# EAGLE design Unified_Circuit (EAGLE 6.3)
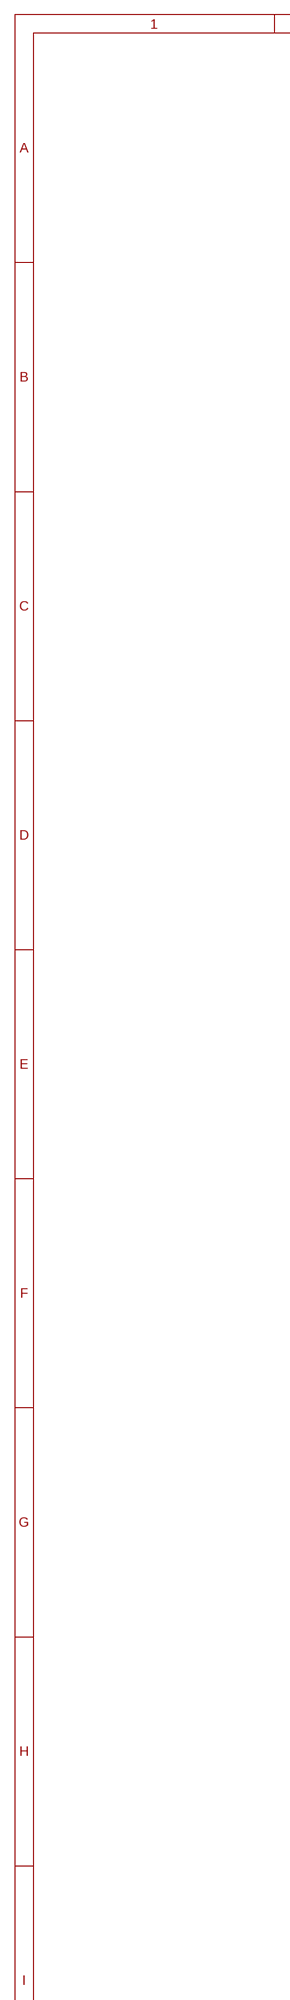
[diagram p0: schematic, sheet 1, part 1 of 2]
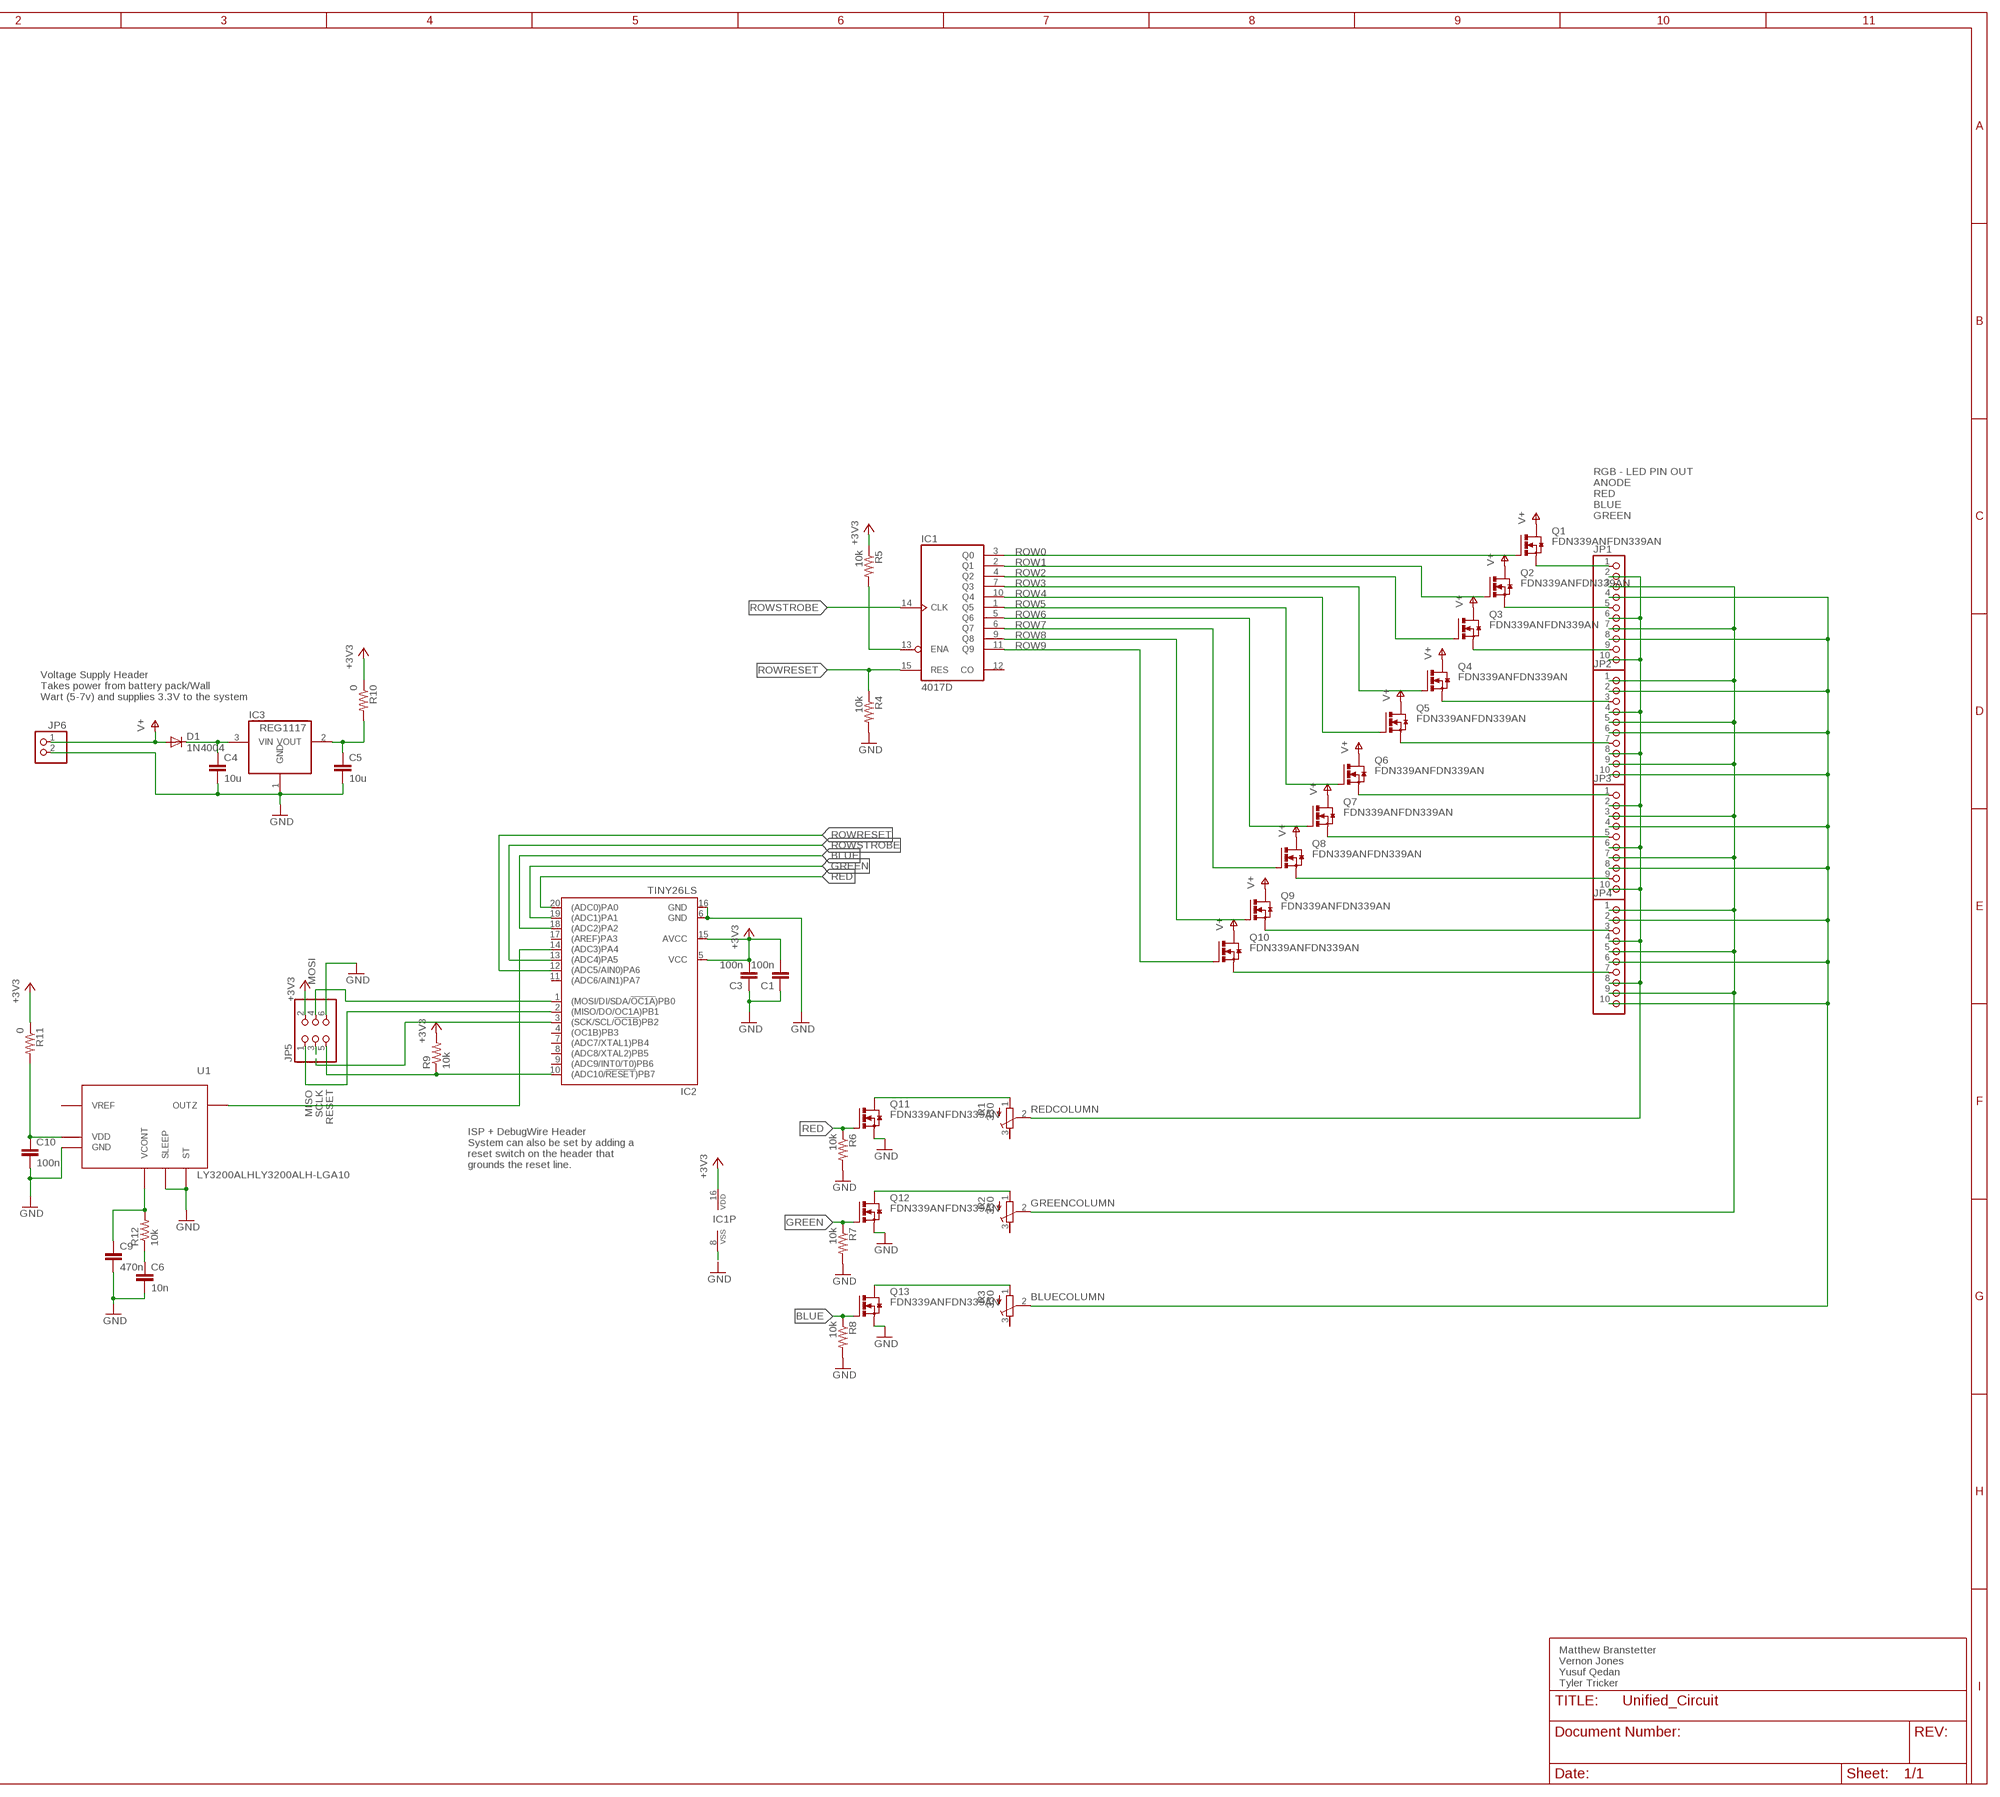
[diagram p1: schematic, sheet 1, part 2 of 2]

## Parts
C1  100n  C-EUC0805  [C0805]
C3  100n  C-EUC0805  [C0805]
C4  10u  C-EUC0805  [C0805]
C5  10u  C-EUC0805  [C0805]
C6  10n  C-EUC0805  [C0805]
C9  470n  C-EUC0805  [C0805]
C10  100n  C-EUC0805  [C0805]
D1  1N4004  [DO41-10]
IC1  4017D  [SO16]
IC2  TINY26LS  [SO20L]
IC3  REG1117  [SOT223]
JP1  PINHD-1X10/90  [1X10/90]
JP2  PINHD-1X10/90  [1X10/90]
JP3  PINHD-1X10/90  [1X10/90]
JP4  PINHD-1X10/90  [1X10/90]
JP5  PINHD-2X3  [2X03]
JP6  PINHD-1X2  [1X02]
Q1  FDN339ANFDN339AN  [SSOT-3]
Q2  FDN339ANFDN339AN  [SSOT-3]
Q3  FDN339ANFDN339AN  [SSOT-3]
Q4  FDN339ANFDN339AN  [SSOT-3]
Q5  FDN339ANFDN339AN  [SSOT-3]
Q6  FDN339ANFDN339AN  [SSOT-3]
Q7  FDN339ANFDN339AN  [SSOT-3]
Q8  FDN339ANFDN339AN  [SSOT-3]
Q9  FDN339ANFDN339AN  [SSOT-3]
Q10  FDN339ANFDN339AN  [SSOT-3]
Q11  FDN339ANFDN339AN  [SSOT-3]
Q12  FDN339ANFDN339AN  [SSOT-3]
Q13  FDN339ANFDN339AN  [SSOT-3]
R1  330  R-TRIMM3224W  [RTRIM3224W]
R2  330  R-TRIMM3224W  [RTRIM3224W]
R3  330  R-TRIMM3224W  [RTRIM3224W]
R4  10k  R-US_R0805  [R0805]
R5  10k  R-US_R0805  [R0805]
R6  10k  R-US_R0805  [R0805]
R7  10k  R-US_R0805  [R0805]
R8  10k  R-US_R0805  [R0805]
R9  10k  R-US_R0805  [R0805]
R10  0  R-US_R0805  [R0805]
R11  0  R-US_R0805  [R0805]
R12  10k  R-US_R0805  [R0805]
U1  LY3200ALHLY3200ALH-LGA10  [LGA10]

## Nets
+3V3: C1.2 C3.2 IC1.16(VDD) IC2.5(VCC) IC2.15(AVCC) JP5.2 R5.1 R9.2 R10.1 R11.1
BLUE: IC2.18((ADC2)PA2) Q13.P$2(G) R8.1
BLUECOLUMN: JP1.4 JP1.8 JP2.2 JP2.6 JP2.10 JP3.4 JP3.8 JP4.2 JP4.6 JP4.10 R3.2(S)
GND: C1.1 C3.1 C4.2 C5.2 C6.2 C9.2 C10.2 IC1.8(VSS) IC2.6(GND) IC2.16(GND) IC3.1(GND) JP5.6 JP6.2 Q11.P$3(S) Q12.P$3(S) Q13.P$3(S) R4.2 R6.2 R7.2 R8.2 U1.P$2(ST) U1.P$4(GND) U1.P$8(SLEEP)
GREEN: IC2.19((ADC1)PA1) Q12.P$2(G) R7.1
GREENCOLUMN: JP1.3 JP1.7 JP2.1 JP2.5 JP2.9 JP3.3 JP3.7 JP4.1 JP4.5 JP4.9 R2.2(S)
MISO: IC2.2((MISO/DO/OC1A)PB1) JP5.1
MOSI: IC2.1((MOSI/DI/SDA/!OC1A!)PB0) JP5.4
N$1: Q11.P$1(D) R1.1(A)
N$2: Q12.P$1(D) R2.1(A)
N$3: Q13.P$1(D) R3.1(A)
N$6: C4.1 D1.C IC3.3(VIN)
N$7: C5.1 IC3.2(VOUT) R10.2
N$9: IC2.14((ADC3)PA4) U1.P$6(OUTZ)
N$13: C6.1 R12.1
N$14: JP2.3 Q4.P$3(S)
N$15: JP2.7 Q5.P$3(S)
N$16: JP1.1 Q1.P$3(S)
N$17: JP1.5 Q2.P$3(S)
N$18: JP1.9 Q3.P$3(S)
N$19: JP3.1 Q6.P$3(S)
N$20: JP3.5 Q7.P$3(S)
N$21: JP3.9 Q8.P$3(S)
N$22: JP4.3 Q9.P$3(S)
N$23: JP4.7 Q10.P$3(S)
N$24: C9.1 R12.2 U1.P$3(VCONT)
N$27: C10.1 R11.2 U1.P$1(VDD) U1.P$9(VDD)
PA1: IC1.13(ENA) R5.2
RED: IC2.20((ADC0)PA0) Q11.P$2(G) R6.1
REDCOLUMN: JP1.2 JP1.6 JP1.10 JP2.4 JP2.8 JP3.2 JP3.6 JP3.10 JP4.4 JP4.8 R1.2(S)
RESET: IC2.10((ADC10/!RESET!)PB7) JP5.5 R9.1
ROW0: IC1.3(Q0) Q1.P$2(G)
ROW1: IC1.2(Q1) Q2.P$2(G)
ROW2: IC1.4(Q2) Q3.P$2(G)
ROW3: IC1.7(Q3) Q4.P$2(G)
ROW4: IC1.10(Q4) Q5.P$2(G)
ROW5: IC1.1(Q5) Q6.P$2(G)
ROW6: IC1.5(Q6) Q7.P$2(G)
ROW7: IC1.6(Q7) Q8.P$2(G)
ROW8: IC1.9(Q8) Q9.P$2(G)
ROW9: IC1.11(Q9) Q10.P$2(G)
ROWRESET: IC1.15(RES) IC2.12((ADC5/AIN0)PA6) R4.1
ROWSTROBE: IC1.14(CLK) IC2.13((ADC4)PA5)
SCLK: IC2.3((SCK/SCL/!OC1B!)PB2) JP5.3
V+: D1.A JP6.1 Q1.P$1(D) Q2.P$1(D) Q3.P$1(D) Q4.P$1(D) Q5.P$1(D) Q6.P$1(D) Q7.P$1(D) Q8.P$1(D) Q9.P$1(D) Q10.P$1(D)
Unconnected: IC1.12(CO) IC2.4((OC1B)PB3) IC2.7((ADC7/XTAL1)PB4) IC2.8((ADC8/XTAL2)PB5) IC2.9((ADC9/INT0/T0)PB6) IC2.11((ADC6/AIN1)PA7) IC2.17((AREF)PA3) R1.3(E) R2.3(E) R3.3(E) U1.P$7(VREF)

## Notes on the sheet
- RGB - LED PIN OUT
  ANODE
  RED
  BLUE
  GREEN
- Voltage Supply Header
  Takes power from battery pack/Wall
  Wart (5-7v) and supplies 3.3V to the system
- ISP + DebugWire Header
  System can also be set by adding a
  reset switch on the header that
  grounds the reset line.
- Matthew Branstetter
  Vernon Jones
  Yusuf Qedan
  Tyler Tricker

## Library data of the parts
C1 C3-C6 C9 C10 = rcl:C-EU: CAPACITOR, European symbol
D1 = diode:1N4004: DIODE general purpose rectifier, 1 A
IC1 = 40xx:4017: COUNTER/DIVIDER
IC2 = atmel:TINY26*: 8-bit AVR Microcontroller with 2K Bytes Flash Source: http://www.atmel.com .. doc1477.pdf; MPN: ATTINY26L-8SU; OC_FARNELL: 9171665; OC_NEWARK: 01M6921
IC3 = burr-brown:REG1117: 800mA and 1A Low Dropout (LDO) Positive Regulator 1.8V, 2.5V, 2.85V, 3.3V, 5V, and Adj; MPN: REG1117; OC_FARNELL: 1097566; OC_NEWARK: 14P6981
JP1-JP4 = pinhead:PINHD-1X10: PIN HEADER
JP5 = pinhead:PINHD-2X3: PIN HEADER
JP6 = pinhead:PINHD-1X2: PIN HEADER
Q1-Q13 = symbols:FDN339AN
R1-R3 = rcl:R-TRIMM: Trimm resistor
R4-R12 = rcl:R-US_: RESISTOR, American symbol
U1 = symbols:LY3200ALH: MEMS motion sensor: high performance ±2000 dps analog yaw-rate gyroscope

## Board
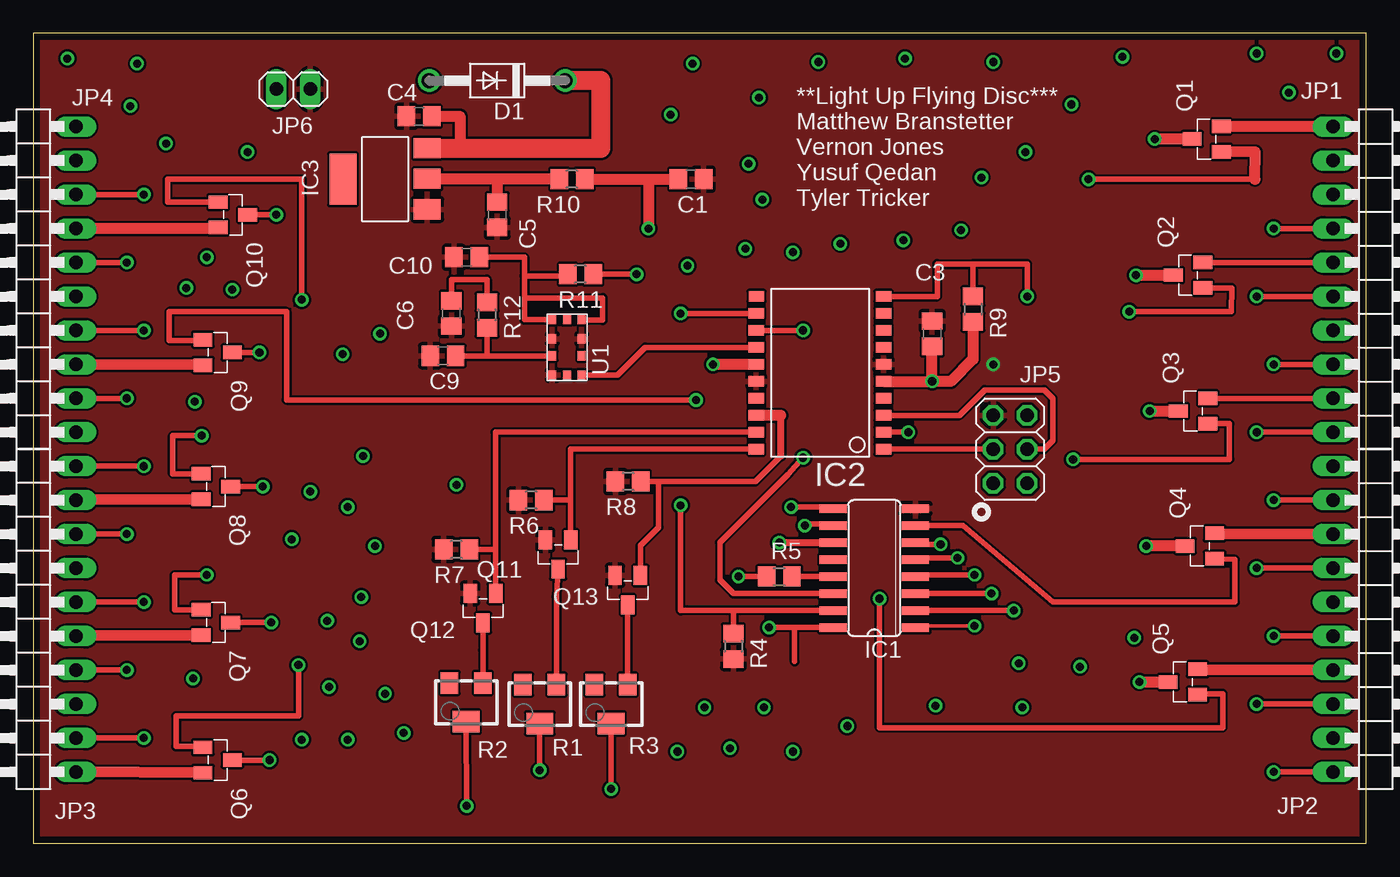
[diagram p2: board, top side]
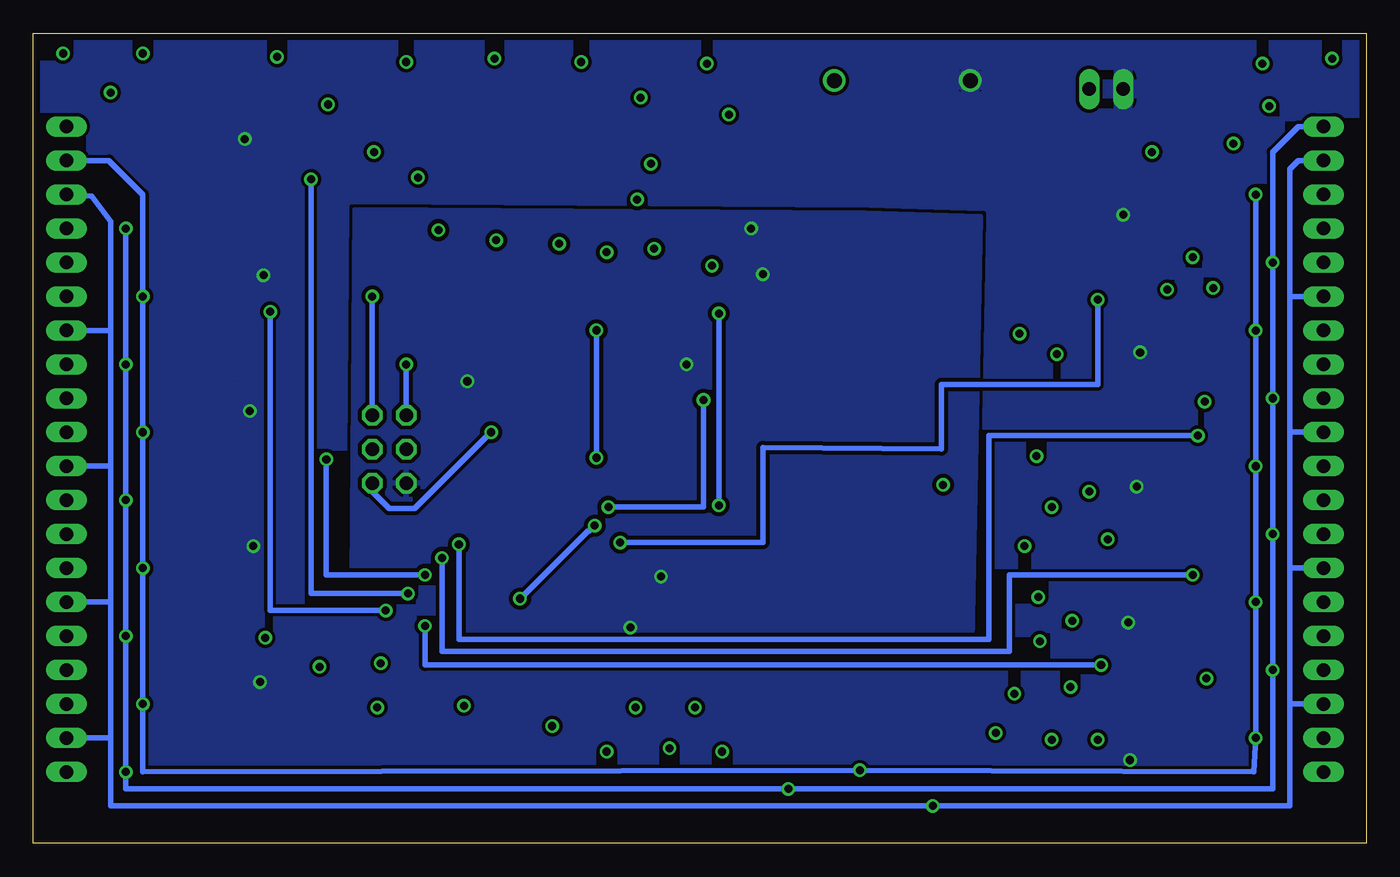
[diagram p3: board, bottom side, seen from below]

Size 99.62 x 60.55 mm. Coordinates in mm from the lower left corner, seen from the top.
Outline: 0,0 99.62,0 99.62,60.55 0,60.55 0,0
Copper layers (1*16): Top 0.0178mm / dielectric 59mil / Bottom 0.0178mm
Design rules "sunstone-valueproto": minimum track width 7mil, minimum drill 16mil, track to track 7mil, track to pad 7mil, pad to pad 7mil, via to via 7mil, smd to smd 7mil, copper to edge 20mil, drill to drill 16mil, minimum pad ring 8mil, minimum via ring 8mil, stop-mask expansion 3mil, vias tented up to drill 0mil, thermal gap 10mil

### Footprints (pad centres in the part's own frame; a part is rotated, then mirrored left to right if it is on the bottom)
C0805 = smd 1.3 x 1.5: 1 -0.95,0; 2 0.95,0
DO41-10 = drill 1.118: A 5.08,0; C -5.08,0
SO16 = smd 0.66 x 2.032: 1 -4.445,-3.073; 2 -3.175,-3.073; 3 -1.905,-3.073; 4 -0.635,-3.073; 5 0.635,-3.073; 6 1.905,-3.073; 7 3.175,-3.073; 8 4.445,-3.073; 9 4.445,3.073; 10 3.175,3.073; 11 1.905,3.073; 12 0.635,3.073; 13 -0.635,3.073; 14 -1.905,3.073; 15 -3.175,3.073; 16 -4.445,3.073
SO20L = smd 0.762 x 1.143: 1 -5.08,-5.131; 2 -3.81,-5.131; 3 -2.54,-5.131; 4 -1.27,-5.131; 5 0,-5.131; 6 1.27,-5.131; 7 2.54,-5.131; 8 3.81,-5.131; 9 5.08,-5.131; 10 6.35,-5.131; 11 6.35,4.369; 12 5.08,4.394; 13 3.81,4.394; 14 2.54,4.394; 15 1.27,4.394; 16 0,4.394; 17 -1.27,4.394; 18 -2.54,4.394; 19 -3.81,4.394; 20 -5.08,4.394
SOT223 = smd 1.499 x 2.007: 1 -2.261,-3.15; 2 0.025,-3.15; 3 2.311,-3.15 | smd 3.81 x 2.007: 4 0,3.15
1X10/90 = drill 1.016 long: 1 -11.43,-3.81; 2 -8.89,-3.81; 3 -6.35,-3.81; 4 -3.81,-3.81; 5 -1.27,-3.81; 6 1.27,-3.81; 7 3.81,-3.81; 8 6.35,-3.81; 9 8.89,-3.81; 10 11.43,-3.81
2X03 = drill 1.016 octagon: 1 -2.54,-1.27; 2 -2.54,1.27; 3 0,-1.27; 4 0,1.27; 5 2.54,-1.27; 6 2.54,1.27
1X02 = drill 1.016 long: 1 -1.27,0; 2 1.27,0
SSOT-3 = smd 1 x 1.4: P$1 0,1.1; P$2 -0.95,-1.1; P$3 0.95,-1.1
RTRIM3224W = smd 1.3 x 1.6: 1 -1.25,-1.45; 3 1.25,-1.45 | smd 2 x 1.6: 2 0,1.45
R0805 = smd 1.3 x 1.5: 1 -0.95,0; 2 0.95,0
LGA10 = smd 0.7 x 0.6: P$1 -2.075,-1.1; P$2 -0.635,-1.1; P$3 0.635,-1.1; P$4 2.075,-1.1; P$5 2.075,0; P$6 2.075,1.1; P$7 0.635,1.1; P$8 -0.635,1.1; P$9 -2.075,1.1; P$10 -2.075,0

### Placement (x,y rotation side)
C1  49.15,49.66 180 top
C3  67.18,38.1 270 top
C4  28.83,54.36 180 top
C5  34.67,46.99 270 top
C6  31.24,39.62 270 top
C9  30.61,36.45 180 top
C10  32.38,43.81 180 top
D1  34.67,57.02 180 top
IC1  62.87,20.57 90 top
IC2  58.42,34.54 90 top
IC3  26.29,49.66 90 top
JP1  100.97,42.16 270 top
JP2  100.97,16.76 270 top
JP3  -0.64,16.76 90 top
JP4  -0.64,42.16 90 top
JP5  73.03,29.46 90 top
JP6  19.43,56.39 0 top
Q1  87.71,52.65 90 top
Q2  86.31,42.48 90 top
Q3  86.69,32.32 90 top
Q4  87.2,22.23 90 top
Q5  85.93,12.07 90 top
Q6  13.77,6.22 270 top
Q7  13.64,16.51 270 top
Q8  13.64,26.67 270 top
Q9  13.77,36.7 270 top
Q10  14.91,46.99 270 top
Q11  39.22,21.59 180 top
Q12  33.6,17.58 180 top
Q13  44.42,18.92 180 top
R1  37.85,10.41 180 top
R2  32.35,10.54 180 top
R3  43.18,10.41 180 top
R4  52.32,14.73 270 top
R5  55.75,19.94 0 top
R6  37.21,25.65 180 top
R7  31.62,21.97 180 top
R8  44.45,27.05 180 top
R9  70.23,39.94 270 top
R10  40.26,49.66 180 top
R11  40.89,42.55 180 top
R12  33.91,39.5 270 top
U1  39.88,37.08 270 top

### Tracks (layer width: path | path; a pad name or v marks a point on that pad's centre or on a via)
+3V3  (via drill 0.6)
  Top 0.406: R11.1 v45.09,42.55 | v52.7,19.94 R5.1 | IC1.16 56.9,16.13 | 56.9,16.13 v54.99,16.13 | 56.9,13.59 56.9,16.13
  Top 0.813: IC2.15 v50.8,35.81 | IC2.5 v67.18,34.54 | v67.18,34.54 C3.2 | R10.1 45.97,49.66 | 45.97,49.66 v45.97,45.97 | R9.2 70.23,36.2 68.58,34.54 v67.18,34.54 | 45.97,49.66 C1.2
  pour Bottom (isolate 0.305): 37.47,47.12 75.56,47.37 75.82,15.11 29.46,14.99 28.83,46.86
BLUE
  Top 0.406: R8.1 46.74,27.05 | 46.74,27.05 53.98,27.05 55.88,28.96 | Q13.P$2 45.38,22.26 46.74,23.62 46.74,27.05
  Top 0.508: 55.88,28.96 55.88,32
  Top 0.813: 55.88,32 IC2.18
BLUECOLUMN  (via drill 0.6)
  Top 0.406: R3.2 v43.18,4.06 | JP4.6 v6.99,43.43 | v6.99,23.11 JP3.8 | JP3.4 v6.99,12.95 | JP4.2 v6.99,33.27 | v92.71,45.97 JP1.4 | v92.71,35.81 JP1.8 | JP2.10 v92.71,5.33 | JP2.2 v92.71,25.65 | JP2.6 v92.71,15.49
  Bottom 0.406: JP4.10 5.08,53.59 6.99,51.69 v6.99,43.43 v6.99,33.27 v6.99,23.11 v6.99,12.95 6.99,4.06 v43.18,4.06 92.71,4.06 v92.71,5.33 v92.71,15.49 v92.71,25.65 v92.71,35.81 v92.71,45.97
GND  (via drill 0.6)
  Bottom 0.406: JP5.6 v71.75,35.81
  pour Top: -0.51,-11.81 101.22,-12.32 101.47,62.74 -0.64,62.74
GREEN
  Top 0.406: IC2.19 34.54,30.73 34.55,23.11 34.55,21.97 | 34.55,21.97 Q12.P$2 | R7.1 34.55,21.97
GREENCOLUMN  (via drill 0.6)
  Top 0.406: R2.2 v32.38,2.79
  Bottom 0.406: JP4.9 5.08,51.05 5.71,50.42 5.71,40.89 | 5.71,40.89 5.71,30.73 | 5.71,30.73 5.71,20.57 | 5.71,20.57 5.71,10.41 | 5.71,10.41 5.71,2.79 v32.38,2.79 93.85,2.79 93.85,7.87 | JP4.5 5.71,40.89 | JP4.1 5.71,30.73 | JP3.7 5.71,20.57 | JP3.3 5.71,10.41 | 93.85,38.35 93.85,46.48 95.25,48.39 JP1.3 | 93.85,38.35 93.85,28.19 | 93.85,28.19 93.85,18.03 | 93.85,18.03 93.85,7.87 | JP1.7 93.85,38.35 | JP2.5 93.85,18.03 | JP2.1 93.85,28.19 | JP2.9 93.85,7.87
MISO  (via drill 0.6)
  Top 0.406: IC2.2 v65.41,30.73
  Bottom 0.406: JP5.1 74.3,26.29 73.03,25.02 71.12,25.02 v65.41,30.73
MOSI
  Top 0.406: JP5.4 IC2.1
N$1
  Top 0.406: Q11.P$1 39.1,18.46 R1.1
N$2
  Top 0.406: Q12.P$1 33.6,14.45 R2.1
N$3
  Top 0.406: Q13.P$1 44.42,11.36 R3.1
N$5  (via drill 0.6)
  other vias: 91.44,59.05
N$6
  Top 0.813: C4.1 31.88,54.36 31.88,51.97
  Top 1.422: IC3.3 31.88,51.97 42.42,51.97 42.42,57.02 D1.C
N$7
  Top 0.406: 39.31,49.68 R10.2
  Top 0.813: IC3.2 34.67,49.68 | 34.67,49.68 C5.1 | 34.67,49.68 39.31,49.68
N$8  (via drill 0.6)
  other vias: 97.41,59.05
N$9
  Top 0.406: U1.P$6 43.65,35.01 45.72,37.08 IC2.14
N$10  (via drill 0.6)
  other vias: 93.85,56.13
N$12  (via drill 0.6)
  other vias: 81.41,58.8
N$13
  Top 0.406: C6.1 31.24,42.16 33.91,42.16 R12.1
N$14
  Top 0.406: JP2.3
  Top 0.813: Q4.P$3 JP2.3
N$15
  Top 0.406: JP2.7
  Top 0.813: Q5.P$3 JP2.7
N$16
  Top 0.406: JP1.1
  Top 0.813: Q1.P$3 JP1.1
N$17
  Top 0.406: Q2.P$3 95.5,43.43 JP1.5
N$18
  Top 0.406: JP1.9 | Q3.P$3 JP1.9
N$19
  Top 0.406: JP3.1
  Top 0.813: Q6.P$3 JP3.1
N$20
  Top 0.406: JP3.5
  Top 0.813: Q7.P$3 JP3.5
N$21
  Top 0.406: JP3.9
  Top 0.813: Q8.P$3 JP3.9
N$22
  Top 0.406: JP4.3
  Top 0.813: Q9.P$3 JP4.3
N$23
  Top 0.406: 13.81,45.97 Q10.P$3 | JP4.7
  Top 0.813: 13.81,45.97 JP4.7
N$24
  Top 0.406: 33.91,36.45 R12.2 | C9.1 33.91,36.45 | 33.91,36.45 U1.P$3
N$25  (via drill 0.6)
  other vias: 77.6,55.24
N$26  (via drill 0.6)
  other vias: 74.17,51.69
N$27
  Top 0.406: C10.1 36.7,43.81 36.7,42.42 | 41.4,39.16 U1.P$9 41.38,39.12 42.55,39.12 42.55,40.77 36.7,40.77 | 36.7,42.42 36.7,40.77 | 36.7,40.77 36.7,39.16 U1.P$1 | R11.2 39.94,42.42 36.7,42.42
N$28  (via drill 0.6)
  other vias: 70.87,49.78
N$29  (via drill 0.6)
  other vias: 71.75,58.42
N$30  (via drill 0.6)
  other vias: 65.15,58.67
N$31  (via drill 0.6)
  other vias: 58.67,58.42
N$32  (via drill 0.6)
  other vias: 54.23,55.75
N$33  (via drill 0.6)
  other vias: 49.28,58.29
N$34  (via drill 0.6)
  other vias: 47.62,54.48
N$35  (via drill 0.6)
  other vias: 53.47,50.8
N$36  (via drill 0.6)
  other vias: 54.48,48.13
N$37  (via drill 0.6)
  other vias: 53.21,44.45
N$38  (via drill 0.6)
  other vias: 60.33,44.83
N$39  (via drill 0.6)
  other vias: 69.34,45.85
N$40  (via drill 0.6)
  other vias: 22.1,11.68
N$41  (via drill 0.6)
  other vias: 26.29,11.18
N$42  (via drill 0.6)
  other vias: 27.69,8.25
N$43  (via drill 0.6)
  other vias: 23.5,7.75
N$44  (via drill 0.6)
  other vias: 20.07,7.75
N$45  (via drill 0.6)
  other vias: 48.13,6.86
N$46  (via drill 0.6)
  other vias: 50.16,10.16
N$47  (via drill 0.6)
  other vias: 54.61,10.16
N$48  (via drill 0.6)
  other vias: 52.07,7.11
N$49  (via drill 0.6)
  other vias: 56.77,6.86
N$50  (via drill 0.6)
  other vias: 60.83,8.76
N$51  (via drill 0.6)
  other vias: 67.44,10.29
N$52  (via drill 0.6)
  other vias: 73.91,10.16
N$53  (via drill 0.6)
  other vias: 73.66,13.46
N$54  (via drill 0.6)
  other vias: 78.23,13.21
N$55  (via drill 0.6)
  other vias: 82.3,15.37
N$56  (via drill 0.6)
  other vias: 19.3,22.73
N$57  (via drill 0.6)
  other vias: 20.7,26.29
N$58  (via drill 0.6)
  other vias: 24.64,28.96
N$59  (via drill 0.6)
  other vias: 25.53,22.23
N$60  (via drill 0.6)
  other vias: 23.5,25.15
N$61  (via drill 0.6)
  other vias: 11.94,12.32
N$62  (via drill 0.6)
  other vias: 21.97,16.64
N$63  (via drill 0.6)
  other vias: 24.38,15.11
N$64  (via drill 0.6)
  other vias: 24.51,18.41
N$65  (via drill 0.6)
  other vias: 31.62,26.8
N$66  (via drill 0.6)
  other vias: 12.06,33.02
N$67  (via drill 0.6)
  other vias: 23.11,36.58
N$68  (via drill 0.6)
  other vias: 25.91,38.1
N$69  (via drill 0.6)
  other vias: 11.43,41.53
N$70  (via drill 0.6)
  other vias: 12.95,43.81
N$71  (via drill 0.6)
  other vias: 14.86,41.4
N$72  (via drill 0.6)
  other vias: 9.91,52.32
N$73  (via drill 0.6)
  other vias: 16,51.69
N$74  (via drill 0.6)
  other vias: 2.54,58.67
N$75  (via drill 0.6)
  other vias: 7.75,58.29
N$76  (via drill 0.6)
  other vias: 7.24,55.12
N$77  (via drill 0.6)
  other vias: 56.77,44.2
N$78  (via drill 0.6)
  other vias: 65.02,45.09
N$79  (via drill 0.6)
  other vias: 48.9,43.18
PA1
  Top 0.406: IC1.13 R5.2
RED
  Top 0.406: IC2.20 40.17,29.46 40.17,25.65 | 40.17,25.65 Q11.P$2 | R6.1 40.17,25.65
REDCOLUMN  (via drill 0.6)
  Top 0.406: R1.2 v37.85,5.46 | JP4.8 v8.26,48.51 | JP3.6 v8.26,18.03 | JP3.10 v8.26,28.19 | v8.26,38.35 JP4.4 | v91.44,40.89 JP1.6 | JP1.10 v91.44,30.73 | JP2.4 v91.44,20.57 | JP2.8 v91.44,10.41 | JP3.2 v8.26,7.87
  Bottom 0.406: v8.26,48.51 v8.26,38.35 v8.26,28.19 v8.26,18.03 v8.26,7.87 8.38,5.33 v37.85,5.46 91.44,5.33 v91.44,10.41 v91.44,20.57 v91.44,30.73 v91.44,40.89 91.44,48.51 93.98,51.05 JP1.2
RESET  (via drill 0.6)
  Top 0.406: IC2.10 67.56,40.89 67.56,43.31 70.23,43.31 | 70.23,43.31 R9.1 | v74.3,40.89 74.3,43.31 70.23,43.31
  Bottom 0.406: JP5.5 v74.3,40.89
ROW0  (via drill 0.6)
  Top 0.254: 66.04,18.8 IC1.3 65.79,18.8
  Top 0.406: v71.63,18.67 IC1.3 | v78.87,49.66 91.31,49.66
  Top 0.813: 91.31,49.66 91.34,51.69 Q1.P$2
  Bottom 0.406: v71.63,18.67 78.87,18.67 v78.87,49.66
ROW1  (via drill 0.6)
  Top 0.254: 66.04,17.53 IC1.2
  Top 0.406: v81.92,39.75 89.53,39.75 89.57,41.53 Q2.P$2 | v73.28,17.4 IC1.2
  Bottom 0.406: v73.28,17.4 81.92,17.4 v81.92,39.75
ROW2  (via drill 0.6, 0.61)
  Top 0.254: 66.04,20.07 IC1.4
  Top 0.406: 66.04,20.07 v70.36,20.07 | Q3.P$2 89.41,31.37 89.41,28.7 v77.72,28.7
  Bottom 0.406: v70.36,20.07 77.72,20.07 v77.72,28.7
ROW3
  Top 0.406: IC1.7 69.47,23.75 76.2,18.03 89.82,18.03 89.82,21.21 Q4.P$2
ROW4  (via drill 0.6, 0.61)
  Top 0.254: 59.69,23.88 IC1.10
  Top 0.406: v63.25,18.29 63.25,8.64 88.9,8.64 88.9,11.18 87.03,11.18 Q5.P$2 | 59.69,23.88 57.66,23.88 v57.66,23.75
  Bottom 0.406: v63.25,18.29 58.17,23.37 58.04,23.37 v57.66,23.75
ROW5  (via drill 0.6, 0.61)
  Top 0.254: v70.36,16.26 66.04,16.26 IC1.1
  Top 0.406: Q6.P$2 12.67,7.24 10.67,7.24 10.67,9.53 19.81,9.53 v19.81,13.34
  Bottom 0.406: v19.81,13.34 70.36,13.34 v70.36,16.26
ROW6  (via drill 0.6)
  Top 0.254: 66.04,21.34 IC1.5
  Top 0.406: Q7.P$2 10.54,17.46 10.54,20.07 v12.95,20.07 | 66.04,21.34 v69.09,21.34
  Bottom 0.406: v12.95,20.07 26.67,20.07 26.67,14.35 69.09,14.35 v69.09,21.34
ROW7  (via drill 0.61)
  Top 0.254: 66.04,22.35 IC1.6
  Top 0.406: Q8.P$2 10.41,27.62 10.41,30.48 v12.57,30.48 | 66.04,22.35 v67.82,22.35
  Bottom 0.406: v12.57,30.48 28.19,30.48 28.19,15.24 67.82,15.24 v67.82,22.35
ROW8  (via drill 0.6, 0.61)
  Top 0.254: 59.69,25.15 IC1.9
  Top 0.406: 59.69,25.15 v56.64,25.15 | Q9.P$2 12.67,37.59 10.16,37.59 10.16,39.75 18.92,39.75 18.92,33.15 v49.53,33.15
  Bottom 0.406: v56.64,25.15 49.53,25.15 v49.53,33.15
ROW9  (via drill 0.6)
  Top 0.254: 59.69,22.61 IC1.11
  Top 0.406: Q10.P$2 10.03,47.94 10.03,49.66 20.07,49.66 v20.07,40.64
  Top 0.508: v55.75,22.48 IC1.11
  Bottom 0.254: 55.63,22.35 v55.75,22.48
  Bottom 0.406: v55.75,22.48 45.09,22.48 45.09,29.59 31.75,29.46 31.75,34.29 20.07,34.29 v20.07,40.64
ROWRESET  (via drill 0.6)
  Top 0.406: IC2.12 v48.39,39.62 | IC1.15 52.32,17.4 | 52.32,17.4 R4.1 | 52.32,17.4 48.39,17.4 v48.39,25.27
  Bottom 0.406: v48.39,25.27 v48.39,39.62
ROWSTROBE  (via drill 0.61)
  Top 0.254: 59.69,18.8 IC1.14
  Top 0.406: v57.53,38.35 IC2.13 | v57.53,28.83 56.39,27.56 51.31,22.48 51.31,19.69 52.32,18.67 IC1.14
  Bottom 0.406: v57.53,28.83 v57.53,38.35
SCLK
  Top 0.406: IC2.3 69.22,32 71.12,33.91 75.56,33.91 76.2,33.27 76.2,30.1 75.56,29.46 JP5.3
V+  (via drill 0.6)
  Top 0.406: Q7.P$1 v17.78,16.51 | Q8.P$1 v17.14,26.67 | Q6.P$1 v17.65,6.22 | Q9.P$1 v16.89,36.7 | Q10.P$1 v18.16,46.99
  Top 0.813: v82.68,12.07 Q5.P$1 | Q4.P$1 v83.19,22.23 | v82.42,42.48 Q2.P$1 | v83.44,32.32 Q3.P$1 | Q1.P$1 v83.82,52.65
  pour Bottom (isolate 0.254, rank 2, hatched): -2.67,64.26 2.92,66.55 9.91,64.77 84.2,65.15 98.68,66.42 103.63,63.5 102.87,-13.46 -1.91,-12.57

### Text on the board
tPlace: **Light Up Flying Disc*** / Matthew Branstetter / Vernon Jones / Yusuf Qedan / Tyler Tricker